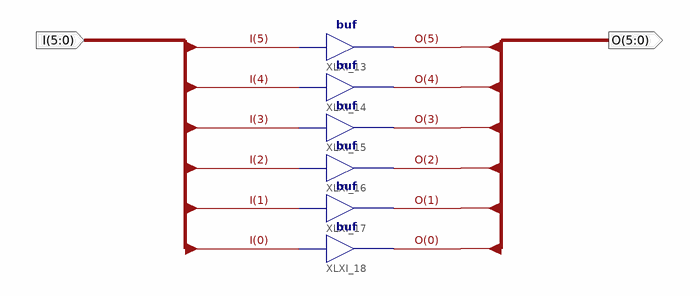
[diagram p0: schematic sheet 1]
// Xilinx ISE schematic Buf6.sch (xc9500xl) as structural Verilog: 6 symbols, 2 ports
module Buf6 (
  input  [5:0] I,
  output [5:0] O
);

  buf XLXI_13 (O[5], I[5]);
  buf XLXI_14 (O[4], I[4]);
  buf XLXI_15 (O[3], I[3]);
  buf XLXI_16 (O[2], I[2]);
  buf XLXI_17 (O[1], I[1]);
  buf XLXI_18 (O[0], I[0]);
endmodule
